# EAGLE design dual_sensor_module (EAGLE 9.6.1)
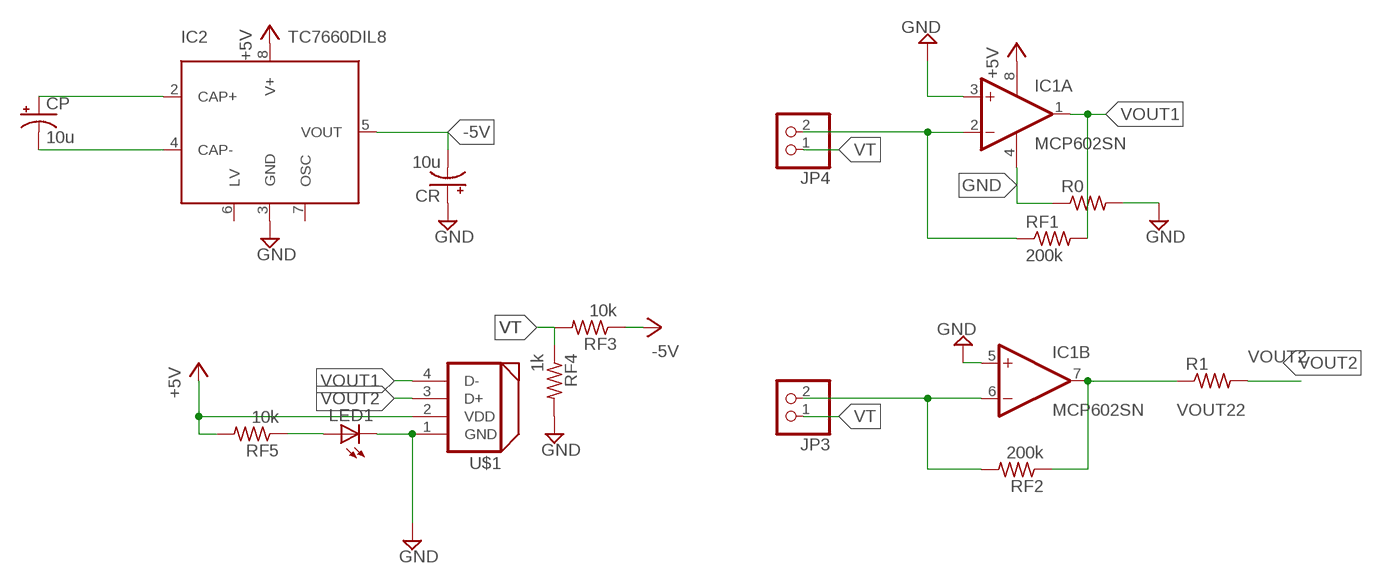
[diagram p0: schematic, sheet 1]

## Parts
CP  10u  CPOL-USE2.5-5  [E2,5-5]
CR  10u  CPOL-USE2.5-5  [E2,5-5]
IC1  MCP602SN  [SO08]
IC2  TC7660DIL8  [DIL8]
JP3  PINHD-1X2  [1X02]
JP4  PINHD-1X2  [1X02]
LED1  LED3MM  [LED3MM]
R0  R-US_R1206  [R1206]
R1  R-US_R1206  [R1206]
RF1  200k  R-US_R0805  [R0805]
RF2  200k  R-US_R0805  [R0805]
RF3  10k  R-US_R0805  [R0805]
RF4  1k  R-US_R0805  [R0805]
RF5  10k  R-US_R0805  [R0805]
U$1  DYNAMIXEL_RS485  [DYNAMIXEL_SPOX_04]

## Nets
+5V: IC1.8(P:V+) IC2.8(V+) RF5.2 U$1.2(VDD)
-5V: CR.- IC2.5(VOUT) RF3.1
GND: CR.+ IC1.3(A:+IN) IC1.4(P:V-) IC1.5(B:+IN) IC2.3(GND) LED1.K(C) R0.1 R0.2 RF4.2 U$1.1(GND)
N$1: CP.+ IC2.2(CAP+)
N$2: CP.- IC2.4(CAP-)
N$3: LED1.A RF5.1
N$52: IC1.2(A:-IN) JP4.2 RF1.1
N$82: IC1.6(B:-IN) JP3.2 RF2.2
VOUT1: IC1.1(A:OUT) RF1.2 U$1.4(D-)
VOUT2: R1.2 U$1.3(D+)
VOUT22: IC1.7(B:OUT) R1.1 RF2.1
VT: JP3.1 JP4.1 RF3.2 RF4.1
Unconnected: IC2.6(LV) IC2.7(OSC)

## Library data of the parts
CP CR = rcl:CPOL-US: POLARIZED CAPACITOR, American symbol; SPICEPREFIX: C
IC1 = dedo:MCP602: Single Op Amp 2.7V to 6.0V Single Supply CMOS Source: http://ww1.microchip.com/downloads/en/DeviceDoc/21314g.pdf
IC2 = microchip_tc7660:TC7660: TC7660 Charge Pump DC-to-DC Voltage Converter
JP3 JP4 = pinhead:PINHD-1X2: PIN HEADER
LED1 = adafruit:LED: LED OSRAM: - CHIPLED LG R971, LG N971, LY N971, LG Q971, LY Q971, LO R971, LY R971 LH N974, LH R974 LS Q976, LO Q976, LY Q976 LO Q996 - Hyper CHIPLED LW Q18S LB Q993, LB Q99A, LB R99A - SideLED LS A670, LO A670, LY A670, LG A670, LP A670 LB A673, LV A673, LT A673, LW A673 LH A674 LY A675 LS A676, LA A676, LO A676, LY A676, LW A676 LS A679, LY A679, LG A679 - Hyper Micro SIDELED® LS Y876, LA Y876, LO Y876, LY Y876 LT Y87S - SmartLED LW L88C, LW L88S LB L89C, LB L89S, LG L890 LS L89K, LO L89K, LY L89K LS L896, LA L896, LO L896, LY L896 - TOPLED LS T670, LO T670, LY T670, LG T670, LP T670 LSG T670, LSP T670, LSY T670, LOP T670, LYG T670 LG T671, LOG T671, LSG T671 LB T673, LV T673, LT T673, LW T673 LH T674 LS T676, LA T676, LO T676, LY T676, LB T676, LH T676, LSB T676, LW T676 LB T67C, LV T67C, LT T67C, LS T67K, LO T67K, LY T67K, LW E67C LS E67B, LA E67B, LO E67B, LY E67B, LB E67C, LV E67C, LT E67C LW T67C LS T679, LY T679, LG T679 LS T770, LO T770, LY T770, LG T770, LP T770 LB T773, LV T773, LT T773, LW T773 LH T774 LS E675, LA E675, LY E675, LS T675 LS T776, LA T776, LO T776, LY T776, LB T776 LHGB T686 LT T68C, LB T68C - Hyper Mini TOPLED® LB M676 - Mini TOPLED Santana® LG M470 LS M47K, LO M47K, LY M47K Source: http://www.osram.convergy.de/
R0 R1 = rcl:R-US_: RESISTOR, American symbol; SPICEPREFIX: R
RF1-RF5 = resistor:R-US_: RESISTOR, American symbol
U$1 = robot-hand:DYNAMIXEL_RS485: Dynamixel RS-485 Connector Molex LLC SPOX 4 Male connector Digikey code: WM18888-ND

## Net classes
0 default: clearance 0.205 mm

## Board
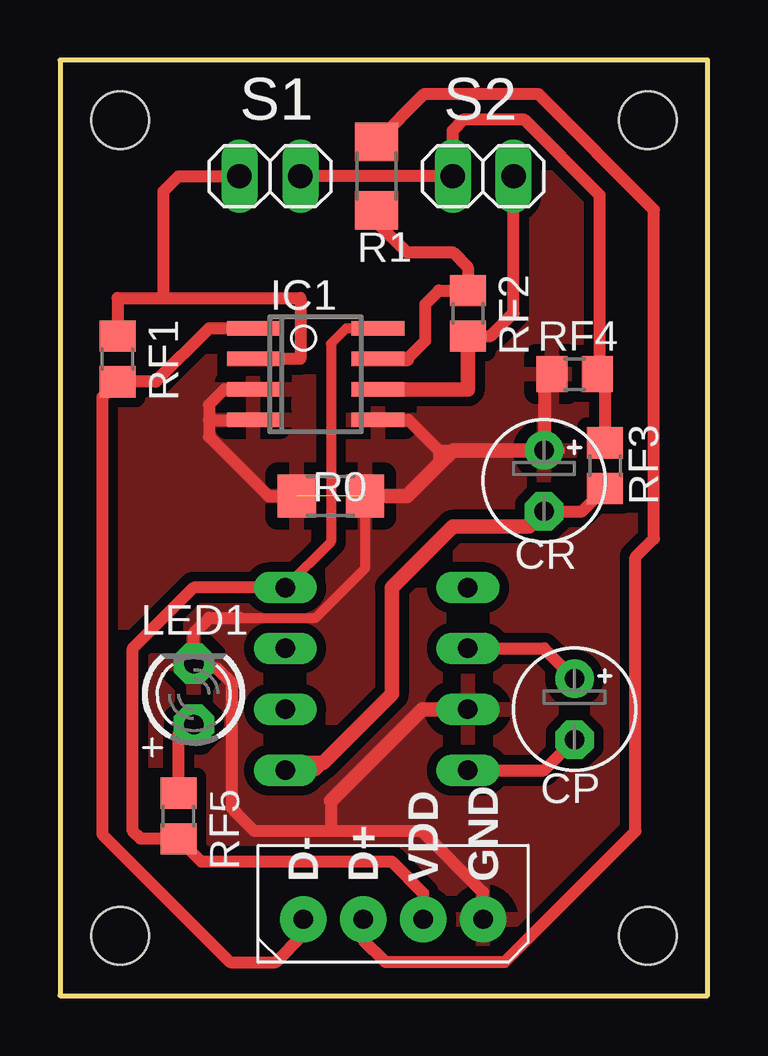
[diagram p1: board, top side]
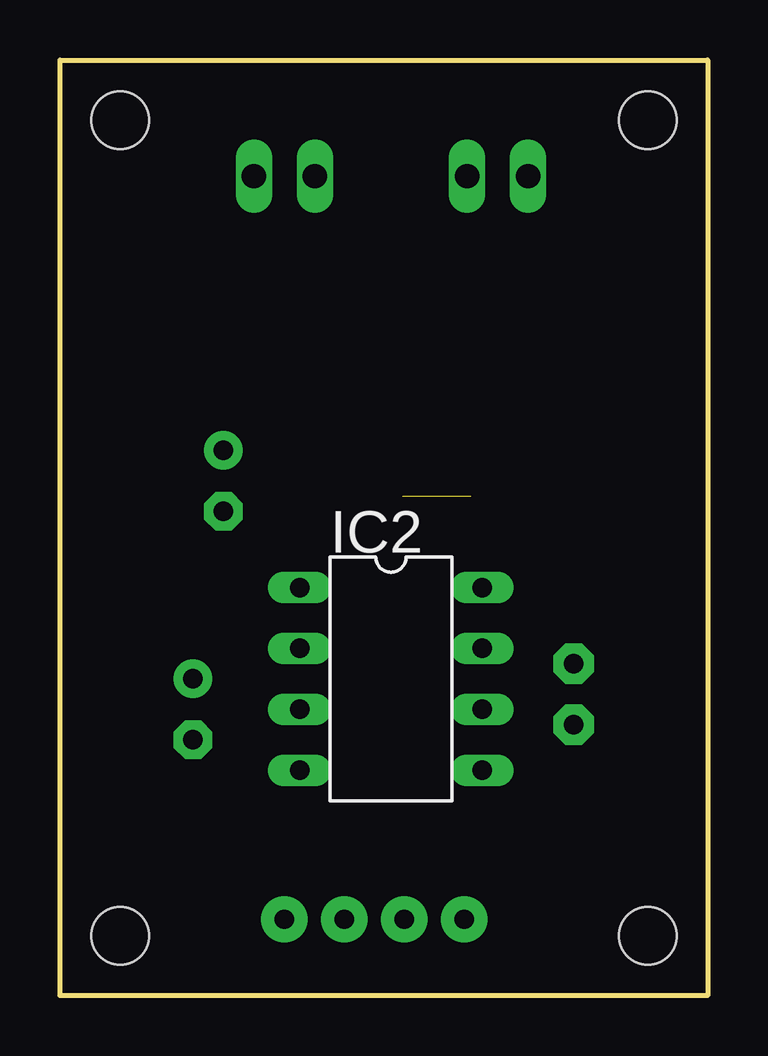
[diagram p2: board, bottom side, seen from below]

Size 27 x 39 mm. Coordinates in mm from the lower left corner, seen from the top.
Outline: 0,0 27,0 27,39 0,39 0,0
Copper layers (1*16): Top 0.035mm / dielectric 1.5mm / Bottom 0.035mm
Design rules "Fablab U. de Chile": minimum track width 0.3mm, minimum drill 0.6mm, track to track 0.3mm, track to pad 0.3mm, pad to pad 0.3mm, via to via 0.3mm, smd to smd 0.3mm, copper to edge 1mm, drill to drill 0.3mm, minimum pad ring 10mil, minimum via ring 10mil, stop-mask expansion 10mil, vias tented up to drill 0mil, thermal gap 20mil
Holes 2.4 mm at 2.5,2.5 24.5,2.5 2.5,36.5 24.5,36.5

### Footprints (pad centres in the part's own frame; a part is rotated, then mirrored left to right if it is on the bottom)
E2,5-5 = drill 0.813 pad 1.6: + -1.27,0 | drill 0.813 pad 1.6 octagon: - 1.27,0
SO08 = smd 0.6 x 2.2: 1 -1.905,-2.6; 2 -0.635,-2.6; 3 0.635,-2.6; 4 1.905,-2.6; 5 1.905,2.6; 6 0.635,2.6; 7 -0.635,2.6; 8 -1.905,2.6
DIL8 = drill 0.813 long: 1 -3.81,-3.81; 2 -1.27,-3.81; 3 1.27,-3.81; 4 3.81,-3.81; 5 3.81,3.81; 6 1.27,3.81; 7 -1.27,3.81; 8 -3.81,3.81
1X02 = drill 1.016 long: 1 -1.27,0; 2 1.27,0
LED3MM = drill 0.813 pad 1.676 octagon: A -1.27,0; K 1.27,0
R1206 = smd 1.6 x 1.803: 1 -1.422,0; 2 1.422,0
R0805 = smd 1.3 x 1.5: 1 -0.95,0; 2 0.95,0
DYNAMIXEL_SPOX_04 = drill 0.8 pad 1.93: 1 0,0; 2 2.5,0; 3 5,0; 4 7.5,0

### Placement (x,y rotation side)
CP  21.45,11.93 270 top
CR  20.18,21.45 270 top
IC1  10.66,25.9 270 top
IC2  13.2,13.2 270 bottom
JP3  17.64,34.16 0 top
JP4  8.76,34.16 180 top
LED1  5.58,12.56 90 top
R0  11.29,20.82 0 top
R1  13.2,34.16 90 top
RF1  2.4,26.54 270 top
RF2  17.01,28.44 270 top
RF3  22.73,22.09 90 top
RF4  21.45,25.9 180 top
RF5  4.95,7.49 270 top
U$1  17.64,3.17 180 top

### Tracks (layer width: path | path; a pad name or v marks a point on that pad's centre or on a via)
+5V
  Top 0.408: IC1.8 11.93,27.8 11.29,27.17 11.29,18.91 IC2.8
  Top 0.508: IC2.8 5.58,17.01 3.04,14.47 3.04,6.85 3.35,6.54 RF5.2 5.9,5.58 13.84,5.58 15.14,4.27 U$1.2
-5V
  Top 0.508: IC2.5 10.03,9.39 10.66,9.39 10.98,9.71 | CR.- 21.77,20.18 RF3.1
  Top 0.61: CR.- 19.55,19.55 16.38,19.55 13.84,17.01 13.84,12.56 10.98,9.71 10.34,9.71 10.03,9.39
GND  (1 unrouted)
  Top 0.305: 13.84,20.82 13.2,20.82 R0.2
  Top 0.406: 7.49,15.74 10.66,15.74 12.72,17.8 R0.2
  Top 0.508: 11.29,6.85 15.11,6.85 17.64,4.31 U$1.1 | 11.29,6.85 8.12,6.85 7.35,7.62 7.17,7.8 7.17,13.01 6.56,13.62 LED1.K 5.58,15.11 6.21,15.74 7.49,15.74 | 14.47,11.29 11.29,8.12 11.29,6.85 | 15.8,22.73 15.8,22.15 15.74,22.09 | R0.1 8.7,20.82 6.21,23.3 6.21,24 | 20.82,22.73 CR.+ 20.18,25.28 20.21,25.31 | 15.8,22.73 16.38,22.73 | RF4.2 20.21,26.19 20.21,25.31 | 20.21,25.31 20.21,23.04 | IC1.5 14.53,24 15.8,22.73 | IC1.3 6.85,25.27 6.21,24.63 6.21,24 | 6.21,24 IC1.4
  Top 0.61: IC2.3 15.11,11.93 11.29,8.12 | CR.+ 16.38,22.73 15.74,22.09 14.47,20.82 13.2,20.82
  pour Top (isolate 0.406): -3.17,40.64 29.84,40.64 29.84,-3.17 -3.17,-3.17
N$1
  Top 0.508: IC2.2 20.18,14.47 CP.+
N$2
  Top 0.508: IC2.4 20.18,9.39 CP.-
N$3
  Top 0.508: RF5.1 4.95,10.88 LED1.A
N$52
  Top 0.508: 4.31,29.07 4.31,33.52 4.95,34.16 JP4.2 | RF1.1 2.4,29.07 4.31,29.07 | 4.31,29.07 10.03,29.07 10.03,26.54 IC1.2
N$82
  Top 0.508: RF2.2 17.96,27.49 18.91,28.44 JP3.2
  Top 0.61: IC1.6 17.01,25.27 RF2.2
VOUT1
  Top 0.508: U$1.4 10.14,2.52 9.01,1.39 7.1,1.39 1.77,6.72 1.77,24.95 RF1.2 4,25.59 6.21,27.8 IC1.1
VOUT2
  Top 0.508: U$1.3 12.64,2.33 13.57,1.4 18.54,1.4 24,6.85 24,18.28 24.77,19.05 24.77,32.75 19.93,37.58 15.21,37.58 R1.2
VOUT22
  Top 0.508: 14.47,26.54 15.23,27.3 15.23,28.82 15.8,29.39 RF2.1 17.01,30.34 16.38,30.98 14.47,30.98 13.2,32.25 R1.1
  Top 0.61: IC1.7 14.47,26.54
VT
  Top 0.508: RF3.2 22.73,25.9 22.62,26.01 RF4.1 22.5,25.99 22.5,33.37 19.34,36.52 16.84,36.52 16.38,36.06 JP3.1 JP4.1

### Text on the board
tNames: S1 | S2